# EAGLE design Buck Regulator (EAGLE 9.6.2)
Datasheet

## Sheet 1 of 2: Datasheet
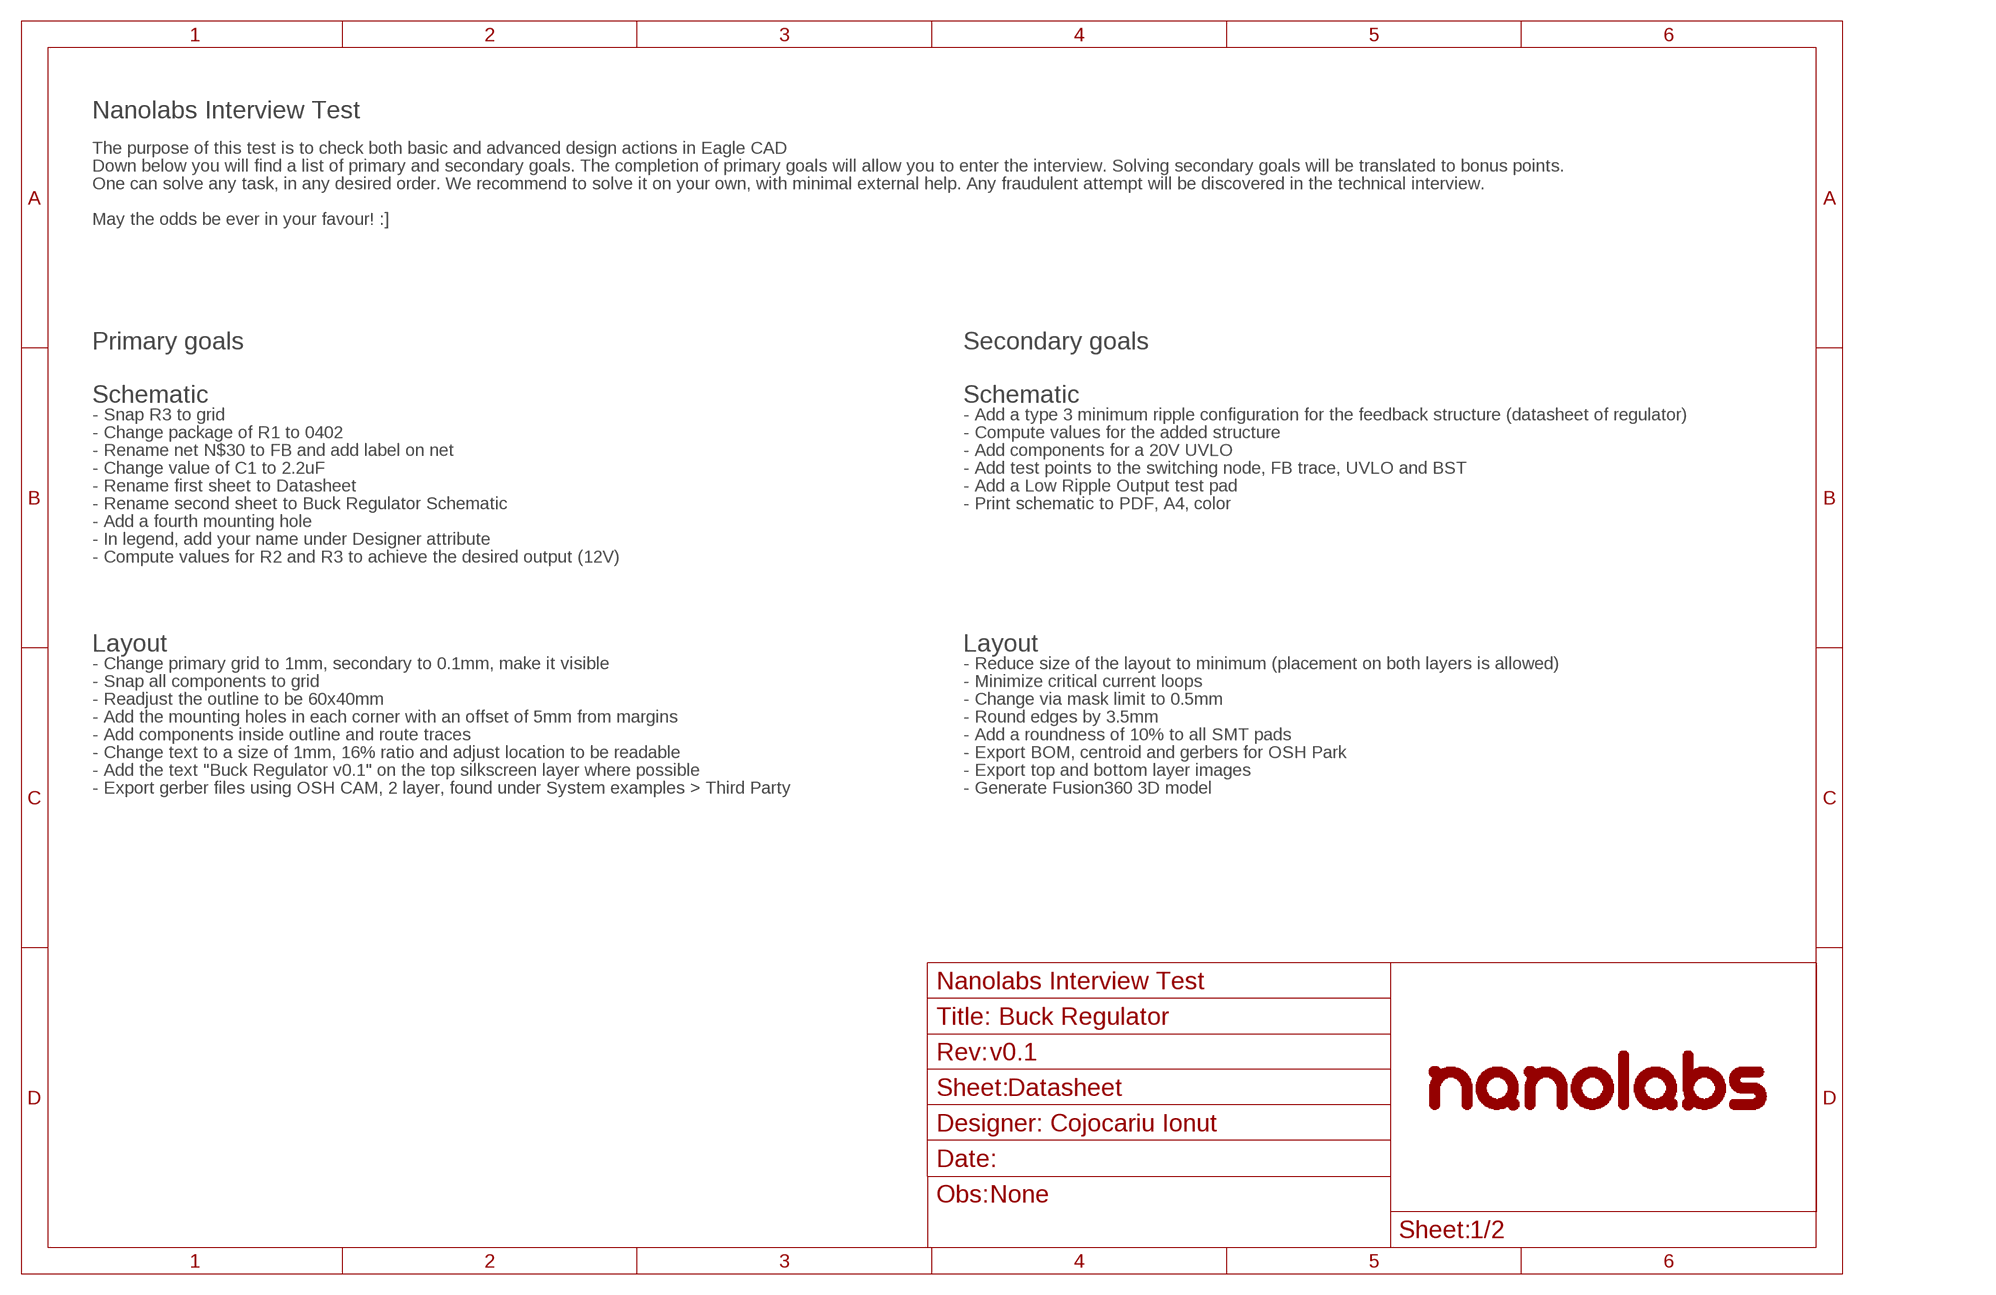
[diagram p0: schematic, sheet 1]
FRAME3 (_SCH_FRAME_A4): OBS: None; REVNUM: v0.1

### Notes on the sheet
- Nanolabs Interview Test
- The purpose of this test is to check both basic and advanced design actions in Eagle CAD
- Down below you will find a list of primary and secondary goals. The completion of primary goals will allow you to enter the interview. Solving secondary goals will be translated to bonus points.
- One can solve any task, in any desired order. We recommend to solve it on your own, with minimal external help. Any fraudulent attempt will be discovered in the technical interview.
- May the odds be ever in your favour! :]
- Primary goals | Secondary goals
- Schematic | Schematic
- - Snap R3 to grid | - Add a type 3 minimum ripple configuration for the feedback structure (datasheet of regulator)
- - Change package of R1 to 0402 | - Compute values for the added structure
- - Rename net N$30 to FB and add label on net | - Add components for a 20V UVLO
- - Change value of C1 to 2.2uF | - Add test points to the switching node, FB trace, UVLO and BST
- - Rename first sheet to Datasheet | - Add a Low Ripple Output test pad
- - Rename second sheet to Buck Regulator Schematic | - Print schematic to PDF, A4, color
- - Add a fourth mounting hole
- - In legend, add your name under Designer attribute
- - Compute values for R2 and R3 to achieve the desired output (12V)
- Layout | Layout
- - Change primary grid to 1mm, secondary to 0.1mm, make it visible | - Reduce size of the layout to minimum (placement on both layers is allowed)
- - Snap all components to grid | - Minimize critical current loops
- - Readjust the outline to be 60x40mm | - Change via mask limit to 0.5mm
- - Add the mounting holes in each corner with an offset of 5mm from margins | - Round edges by 3.5mm
- - Add components inside outline and route traces | - Add a roundness of 10% to all SMT pads
- - Change text to a size of 1mm, 16% ratio and adjust location to be readable | - Export BOM, centroid and gerbers for OSH Park
- - Add the text "Buck Regulator v0.1" on the top silkscreen layer where possible | - Export top and bottom layer images
- - Export gerber files using OSH CAM, 2 layer, found under System examples > Third Party | - Generate Fusion360 3D model

## Sheet 2 of 2: Buck Regulator Schematic
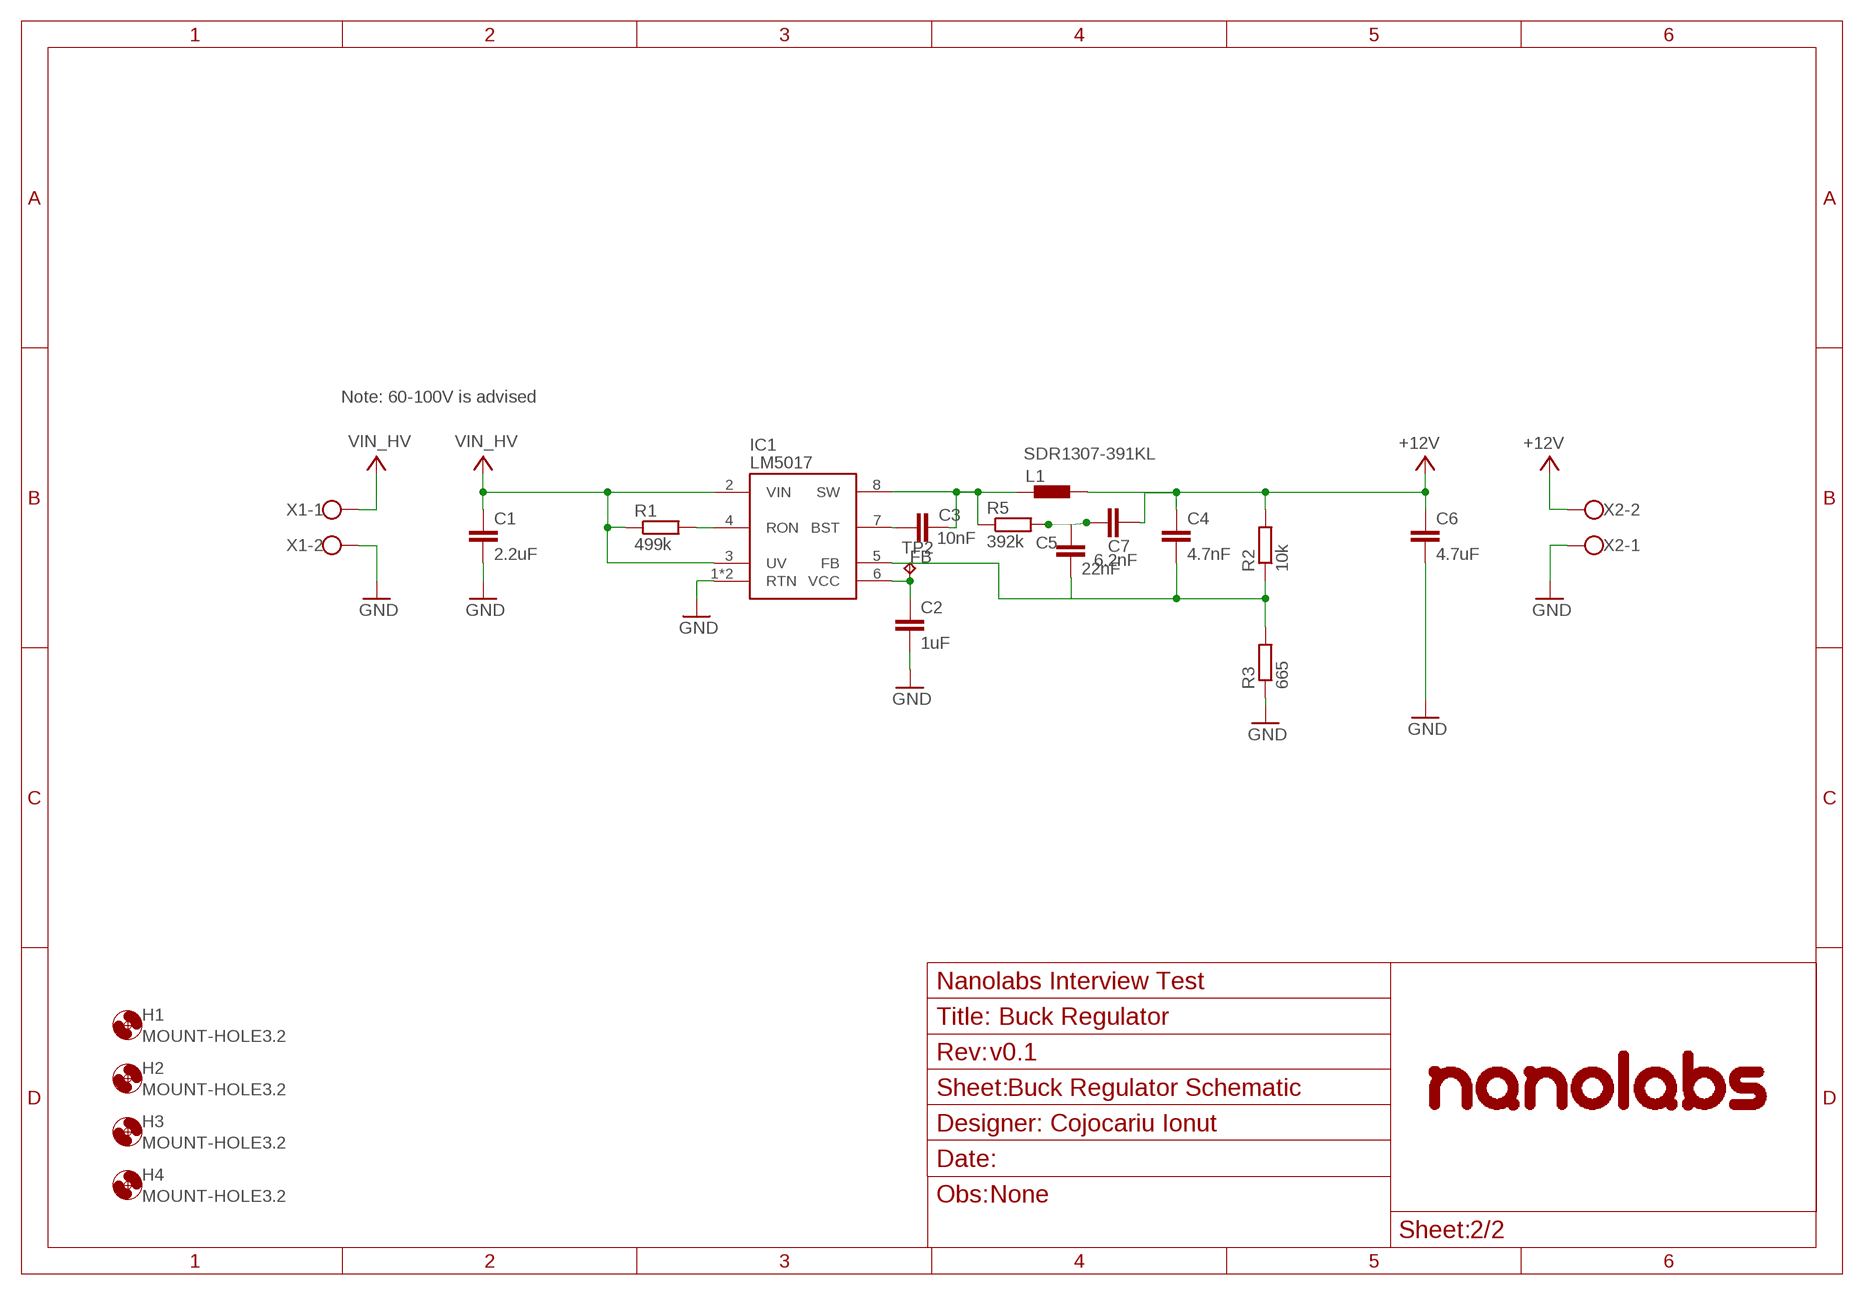
[diagram p1: schematic, sheet 2]
FRAME1 (_SCH_FRAME_A4): OBS: None; REVNUM: v0.1

### Parts
C1  2.2uF  C-EUC1812  [C1812]
C2  1uF  C-EUC0603  [C0603]
C3  10nF  C-EUC0603  [C0603]
C4  4.7nF  C-EUC0603  [C0603]
C5  22nF  C2.5/2  [C2.5-2]
C6  4.7uF  C-EUC0603  [C0603]
C7  6.2nF  C2.5/2  [C2.5-2]
H1  MOUNT-HOLE3.2  [3,2]
H2  MOUNT-HOLE3.2  [3,2]
H3  MOUNT-HOLE3.2  [3,2]
H4  MOUNT-HOLE3.2  [3,2]
IC1  LM5017  [SO-08-EP]
L1  SDR1307-391KL  [SDR1307-391KL]
R1  499k  R-EU_R0402  [R0402]
R2  10k  R-EU_R0603  [R0603]
R3  665  R-EU_R0603  [R0603]
R5  392k  R-EU_R0603  [R0603]
TP2  TPB1,27  [B1,27]
X1  W237-102  [W237-102]
X2  W237-102  [W237-102]

### Nets
+12V: C4.1 C6.1 C7.2 L1.2 R2.2 X2.2
FB: C4.2 C5.2 IC1.5(FB) R2.1 R3.2
GND: C1.2 C2.2 C6.2 IC1.1(RTN) IC1.9(RTN) R3.1 X1.2 X2.1
N$2: C5.1 C7.1 R5.2
N$23: C2.1 IC1.6(VCC) TP2.TP
N$28: C3.1 IC1.7(BST)
N$29: C3.2 IC1.8(SW) L1.1 R5.1
N$31: IC1.4(RON) R1.2
VIN_HV: C1.1 IC1.2(VIN) IC1.3(UV) R1.1 X1.1

### Notes on the sheet
- Note: 60-100V is advised

## Library data of the parts
C1-C4 C6 = rcl:C-EU: CAPACITOR, European symbol; SPICEPREFIX: C
C5 C7 = capacitor-wima:C: CAPACITOR naming: grid - package width
H1-H3 = _nanolabs_layout:MOUNT-HOLE: MOUNTING HOLE with drill center marker
H4 = holes:MOUNT-HOLE: MOUNTING HOLE with drill center marker
IC1 = _nanolabs_ic:LM5017
L1 = _nanolabs_rcl:SDR1307-391KL
R1 R3 R5 = rcl:R-EU_: RESISTOR, European symbol; SPICEPREFIX: R
R2 = rcl:R-EU_: RESISTOR, European symbol; R3: 10k; SPICEPREFIX: R
TP2 = testpad:TP: Test pad
X1 X2 = con-wago-500:W237-102: WAGO SCREW CLAMP; MPN: 237-102; OC_FARNELL: unknown; OC_NEWARK: 70K9898

## Board
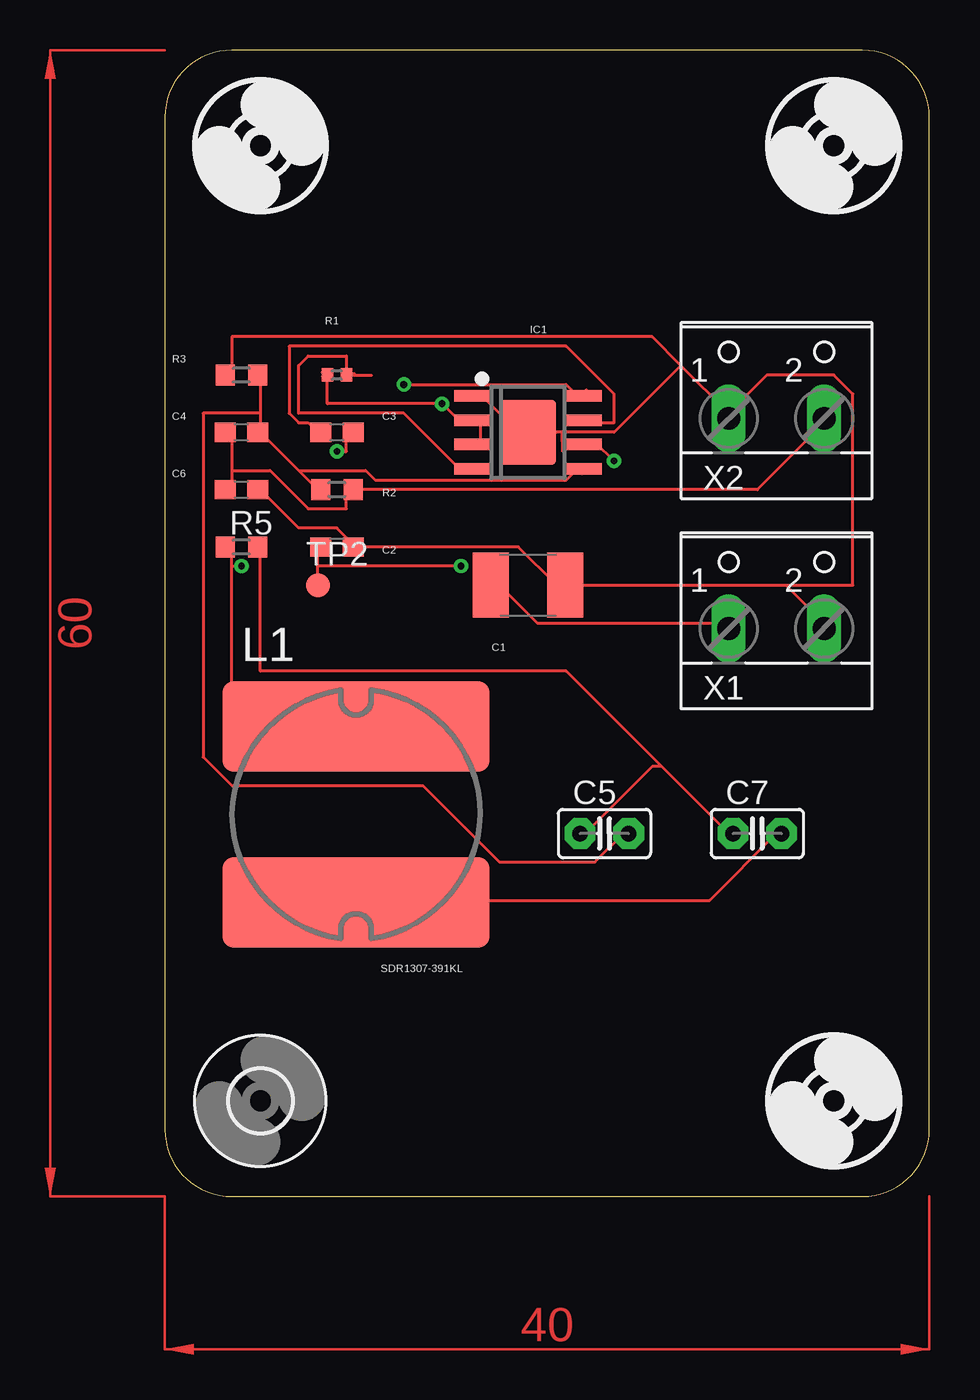
[diagram p2: board, top side]
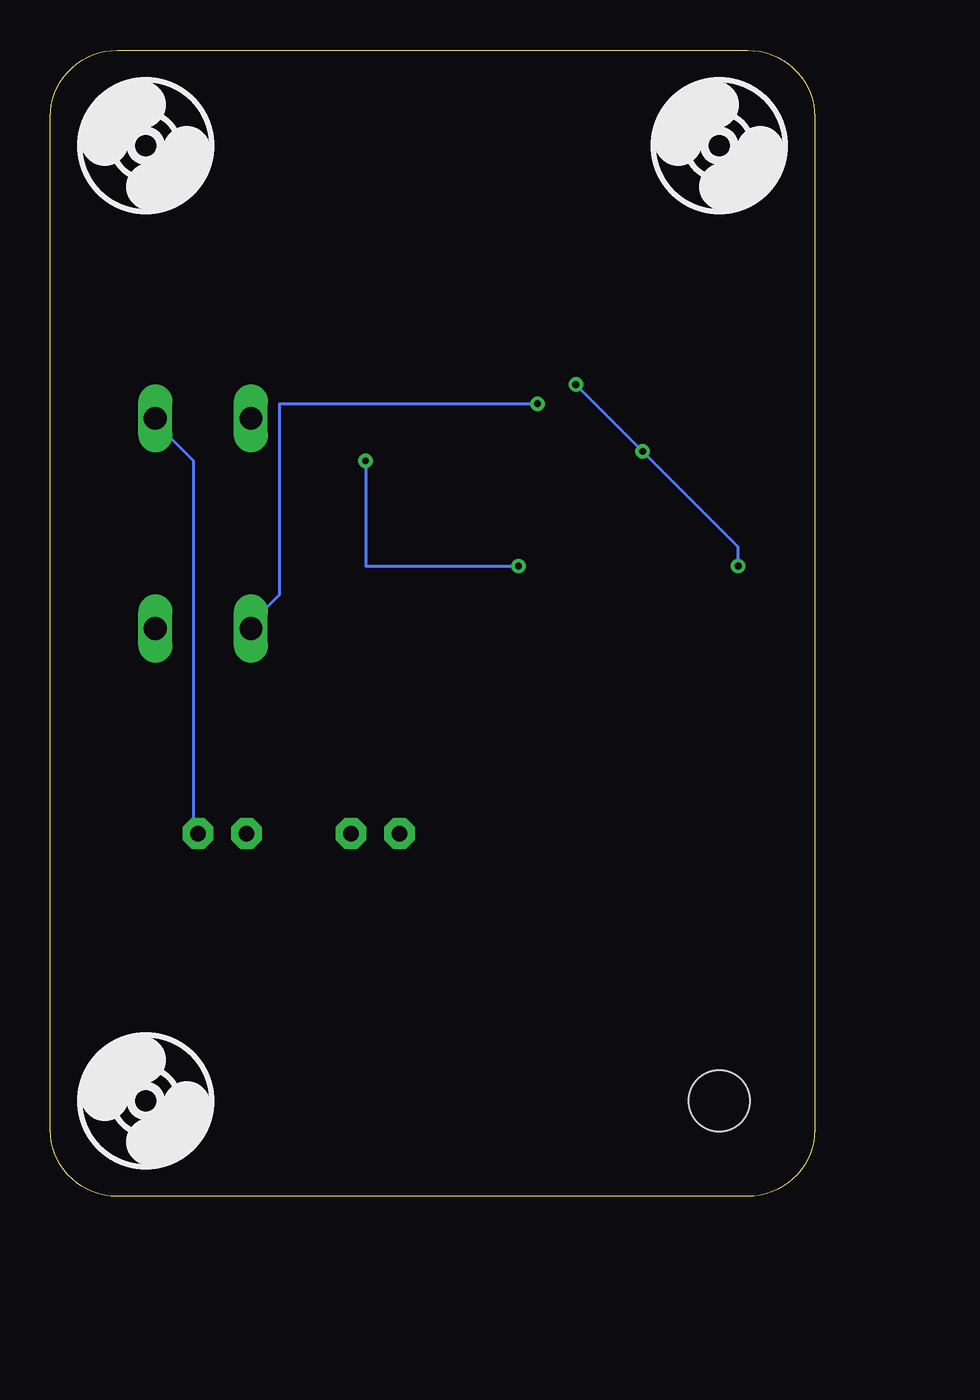
[diagram p3: board, bottom side, seen from below]

Size 40 x 60 mm. Coordinates in mm from the lower left corner, seen from the top.
Outline: 0,56.5 0,3.5 arc90 3.5,0 36.5,0 arc90 40,3.5 40,56.5 arc90 36.5,60 3.5,60 arc90 0,56.5
Copper layers (1*16): Top 0.035mm / dielectric 1.5mm / Bottom 0.035mm
Design rules "default": minimum track width 6mil, minimum drill 0.35mm, track to track 6mil, track to pad 6mil, pad to pad 6mil, via to via 6mil, smd to smd 6mil, copper to edge 40mil, drill to drill 6mil, minimum pad ring 10mil, minimum via ring 8mil, stop-mask expansion 4mil, vias tented up to drill 0mil, thermal gap 10mil

### Footprints (pad centres in the part's own frame; a part is rotated, then mirrored left to right if it is on the bottom)
C1812 = smd 1.9 x 3.4: 1 -1.95,0; 2 1.95,0
C0603 = smd 1.1 x 1: 1 -0.85,0; 2 0.85,0
C2.5-2 = drill 0.813 pad 1.6 octagon: 1 -1.27,0; 2 1.27,0
3,2 = hole 3.2: 0,0
SO-08-EP = smd 0.6 x 1.9: 1 -1.905,-2.9; 2 -0.635,-2.9; 3 0.635,-2.9; 4 1.905,-2.9; 5 1.905,2.9; 6 0.635,2.9; 7 -0.635,2.9; 8 -1.905,2.9 | smd 3.4 x 2.95: 9 0,0
SDR1307-391KL = smd 14 x 4.75: 1 0,4.6; 2 0,-4.6
R0402 = smd 0.6 x 0.7: 1 -0.5,0; 2 0.5,0
R0603 = smd 1 x 1.1: 1 -0.85,0; 2 0.85,0
B1,27 = smd 1.27 x 1.27: TP 0,0
W237-102 = drill 1.194 long: 1 -2.5,-1.27; 2 2.5,-1.27

### Placement (x,y rotation side)
C1  19,32 0 top
C2  9,34 0 top
C3  9,40 0 top
C4  4,40 0 top
C5  23,19 0 top
C6  4,37 0 top
C7  31,19 0 top
H1  35,5 0 top
H2  5,55 0 top
H3  35,55 0 top
H4  5,5 0 top
IC1  19,40 270 top
L1  10,20 0 top
R1  9,43 0 top
R2  9,37 0 top
R3  4,43 0 top
R5  4,34 0 top
TP2  8,32 0 top
X1  32,31 0 top
X2  32,42 0 top

### Tracks (layer width: path | path; a pad name or v marks a point on that pad's centre or on a via)
+12V
  Top 0.152: 9.97,37.07 R2.2 | 3.07,40.01 C4.1 | 3.26,37.01 C6.1 | 3.11,37.01 C6.1 | 3.2,37.14 C6.1 | 3.2,39.93 C4.1 | 9.91,37.03 R2.2 | 3.05,40.08 C4.1 | 9.75,36.88 R2.2 | 9.94,15.39 L1.2 10,15.5 28.5,15.5 32,19 C7.2 | 3.5,38 3.5,40 C4.1 | 3.5,38 3.5,37 C6.1 | 3.5,38 5.5,38 7.5,36 9.5,36 9.5,37 R2.2 | R2.2 31,37 34.5,40.5 X2.2
  Bottom 0.152: X2.2 34.5,40.5 32.5,38.5 32.5,19 C7.2
FB
  Top 0.152: 4.96,42.86 R3.2 | 4.75,39.86 C4.2 | 8.14,37.07 R2.1 | 21.94,38.05 IC1.5 | 4.88,40.08 C4.2 | 4.88,42.98 R3.2 | 7.77,37.03 8.08,37.03 R2.1 | 4.88,39.93 C4.2 | R2.1 8.15,37.15 | 21.83,37.83 IC1.5 | 5,41 5,43 R3.2 | 5,41 5,40 | 5,40 7,38 | 7,38 8,37 R2.1 | 5,40 C4.2 | 7,38 10.5,38 11,37.5 21,37.5 21.5,38 IC1.5 | 5,41 2,41 2,23 3.5,21.5 13.5,21.5 17.5,17.5 22.5,17.5 24,19 C5.2
GND
  Top 0.152: 3.13,43.01 R3.1 | IC1.9 18.89,40.03 | 10,34.07 C2.2 | 4.79,36.86 C6.2 | 20.87,31.92 C1.2 | 9.84,33.92 C2.2 | IC1.1 15.62,41.91 | 9.91,33.98 C2.2 | 20.81,32 C1.2 | 20.83,39 20.8,40 | 20.8,40 20.5,40 IC1.9 | 4.88,37.14 C6.2 | 3.2,42.98 R3.1 | 16.09,41.98 IC1.1 | 4.72,36.83 C6.2 | IC1.9 18.5,40 16.5,42 IC1.1 | 29.5,41 27,43.5 | 27,43.5 25.5,45 3.5,45 3.5,43 R3.1 | 20.8,40 23.5,40 27,43.5 | 10,34 9,35 7,35 5,37 C6.2 | 10,34 18.5,34 20.5,32 C1.2 | 10,34 C2.2 | 32.5,32 34.5,30 X1.2 | C1.2 32.5,32 | 29.5,41 31.5,43 35,43 36,42 36,32 32.5,32 | 29.5,41 X2.1
N$2
  Top 0.152: 26,22.5 29.5,19 C7.1 | 26,22.5 21,27.5 5,27.5 5,34 R5.2 | 26,22.5 25.5,22.5 22,19 C5.1
N$23  (via drill 0.35)
  Top 0.152: 8.17,34.07 C2.1 | IC1.6 22.1,39.54 | 8.53,34.14 8.23,34.14 C2.1 | 22.03,39.54 IC1.6 | TP2.TP 8,33 | 8,33 8,34 C2.1 | v15.5,33 8,33 | v23.5,38.5 22.5,39.5 22,39.5 IC1.6
  Bottom 0.152: v15.5,33 23.5,33 v23.5,38.5
N$28
  Top 0.152: 8.23,40.23 8.23,40.08 C3.1 8,40 7.5,40.5 7,40.5 6.5,41 6.5,44.5 21,44.5 23.5,42 23.5,40.5 22,40.5 IC1.7 22.03,40.6
N$29  (via drill 0.35)
  Top 0.152: 9.72,40.07 C3.2 | 21.79,42.01 IC1.8 | 9.88,24.7 L1.1 | 21.94,41.86 IC1.8 | 9.91,39.93 C3.2 | IC1.8 22.06,42.23 | 9.94,24.54 L1.1 | 3.5,33 3.5,25 10,25 L1.1 | 3.5,33 3.5,34 R5.1 | v9,39 9.5,39 9.5,40 C3.2 | 3.5,33 v4,33 | v12.5,42.5 21,42.5 21.5,42 IC1.8
  Bottom 0.152: v4,33 4,34 v9,39 v12.5,42.5
N$31
  Top 0.152: 9.93,43.07 R1.2 | 16.15,38.05 IC1.4 16,38 15.5,38 12.5,41 7,41 7,43.5 7.5,44 9.5,44 R1.2 | 10.82,42.98 9.91,42.98 R1.2
VIN_HV  (via drill 0.35)
  Top 0.152: 16.15,39.42 IC1.3 | 16.15,40.48 IC1.2 | 8.25,42.92 R1.1 | 16.91,31.92 C1.1 | 15.99,39.27 IC1.3 | 8.53,43.13 8.23,43.13 R1.1 | 16.09,39.39 IC1.3 | 16.09,40.45 IC1.2 | 17,32 C1.1 | 17.17,31.83 C1.1 | R1.1 8.5,41.5 v14.5,41.5 15.5,40.5 16,40.5 IC1.2 | IC1.3 16.5,39.5 16.5,40.5 IC1.2 | C1.1 17.5,32 19.5,30 29.5,30 X1.1
  Bottom 0.152: 29.49,29.87 X1.1 29.5,30 28,31.5 28,41.5 v14.5,41.5
(copper drawn outside any net)
  shapes: Top area x2

### Text on the board
tDocu: Buck Regulator v0.1